# EAGLE schematic frets-main-board (EAGLE 6.6.0)
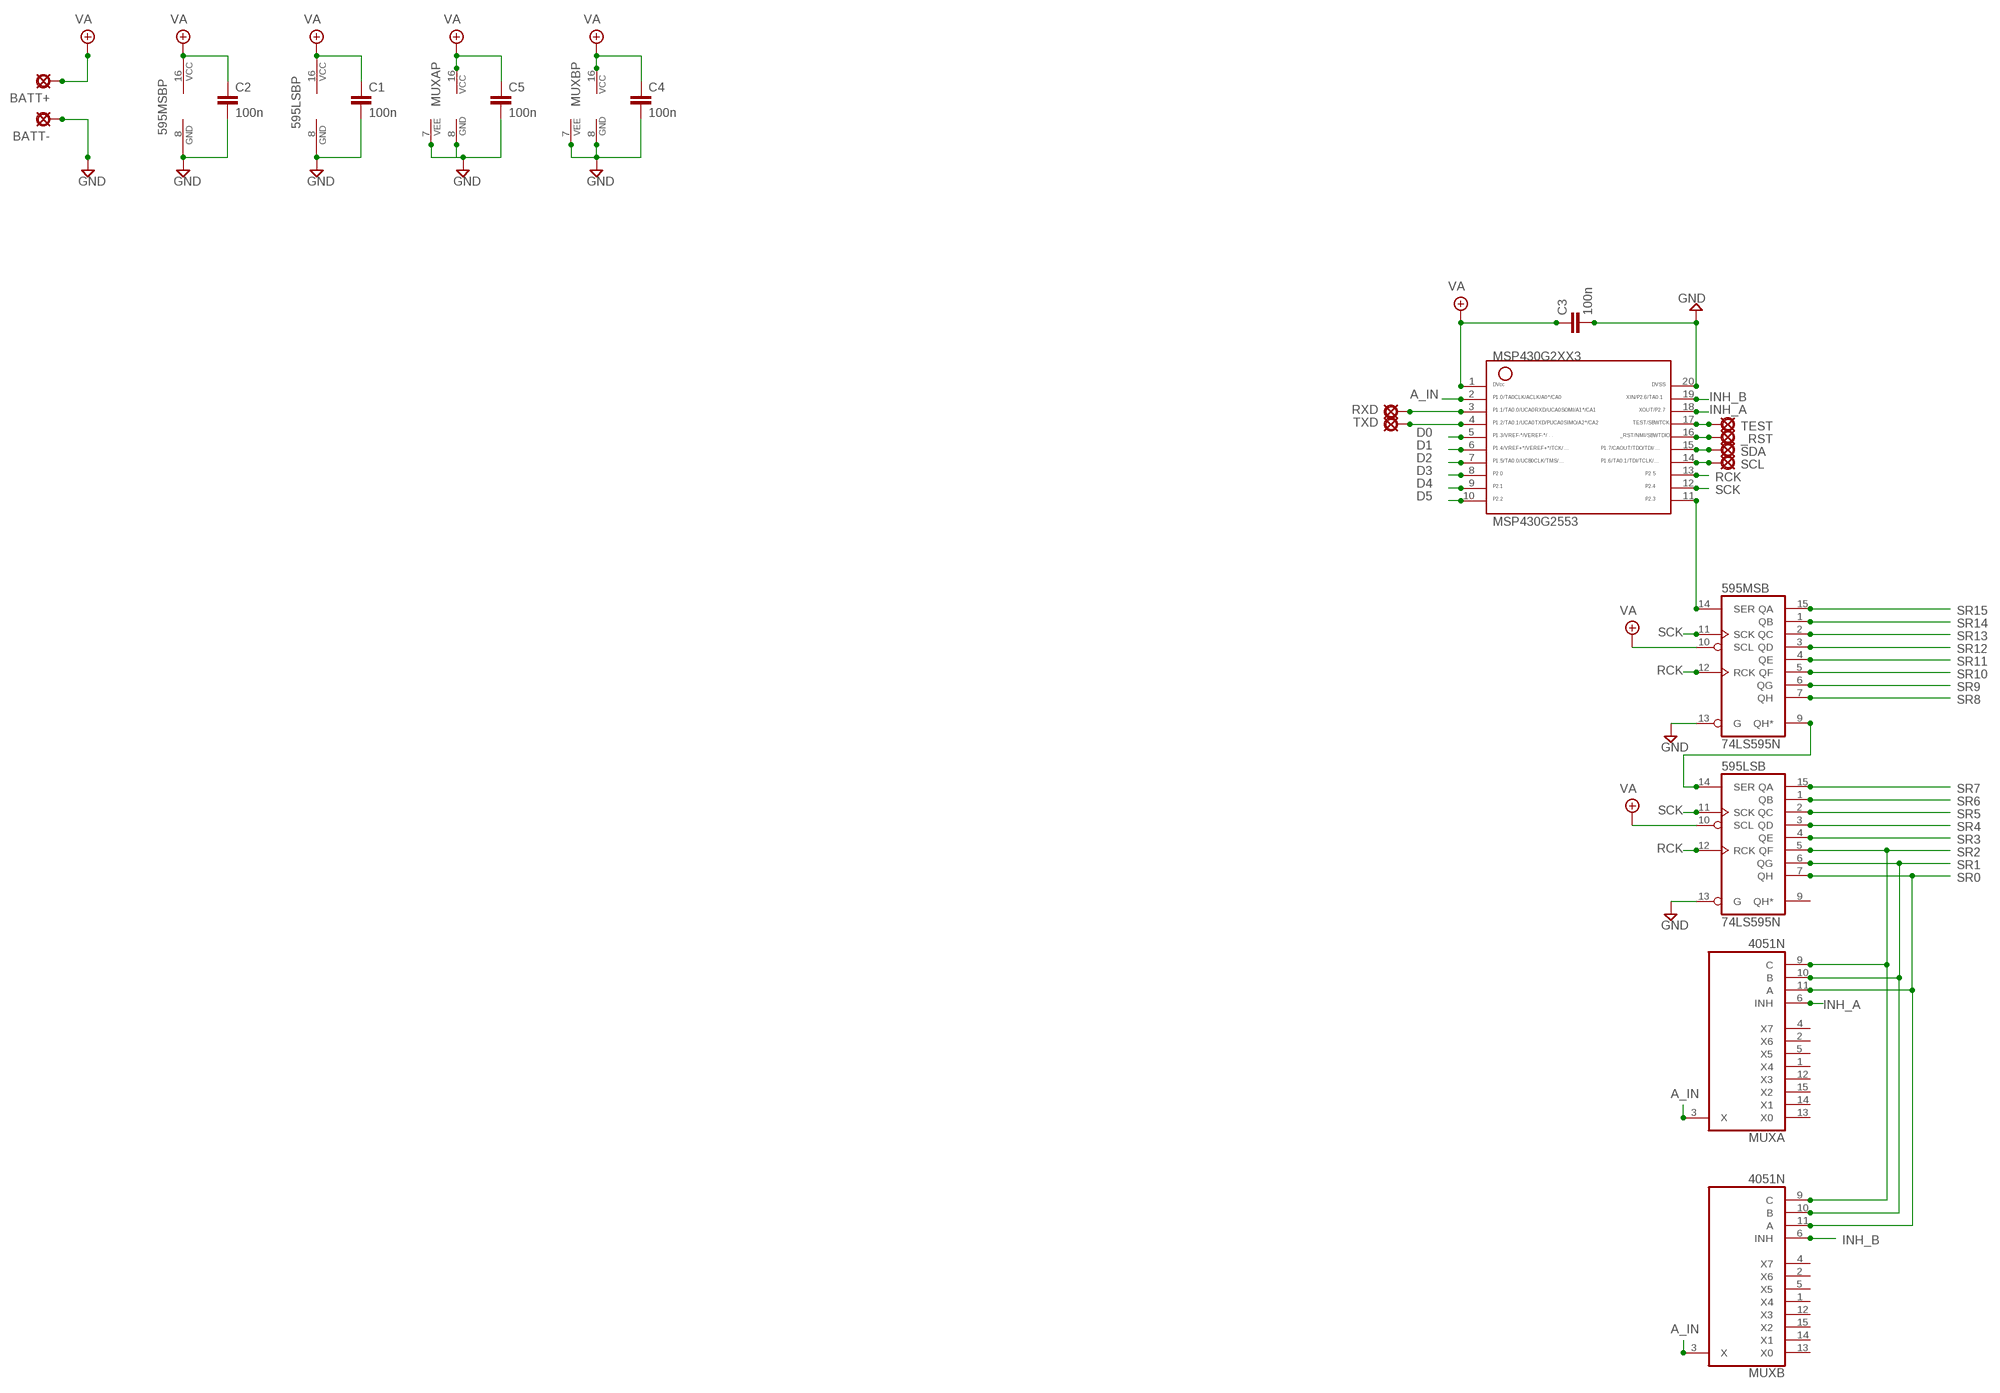
[diagram p0: schematic, sheet 1]

## Parts
595LSB  74LS595N  [DIL16]
595MSB  74LS595N  [DIL16]
_RST  PAD  [SQUARE]
BATT+  PADL  [LONG]
BATT-  PADL  [LONG]
C1  100n  050X030_050  [050X030_050_3]
C2  100n  050X030_050  [050X030_050_3]
C3  100n  050X030_050  [050X030_050_3]
C4  100n  050X030_050  [050X030_050_3]
C5  100n  050X030_050  [050X030_050_3]
MSP430G2553  G2XX3---N20  [N20]
MUXA  4051N  [DIL16]
MUXB  4051N  [DIL16]
RXD  PAD  [SQUARE]
SCL  PAD  [SQUARE]
SDA  PAD8  [OCTOGON]
TEST  PAD8  [OCTOGON]
TXD  PAD8  [OCTOGON]

## Nets
_RST: _RST.1(PAD) MSP430G2553.16
A_IN: MSP430G2553.2 MUXA.3(X) MUXB.3(X)
D0: MSP430G2553.5
D1: MSP430G2553.6
D2: MSP430G2553.7
D3: MSP430G2553.8
D4: MSP430G2553.9
D5: MSP430G2553.10
GND: 595LSB.8(GND) 595LSB.13(G) 595MSB.8(GND) 595MSB.13(G) BATT-.1(PAD) C1.2 C2.2 C3.2 C4.2 C5.2 MSP430G2553.20 MUXA.7(VEE) MUXA.8(GND) MUXB.7(VEE) MUXB.8(GND)
INH_A: MSP430G2553.18 MUXA.6(INH)
INH_B: MSP430G2553.19 MUXB.6(INH)
N$1: 595LSB.14(SER) 595MSB.9(QH*)
RCK: 595LSB.12(RCK) 595MSB.12(RCK) MSP430G2553.13
RXD: MSP430G2553.3 RXD.1(PAD)
SCK: 595LSB.11(SCK) 595MSB.11(SCK) MSP430G2553.12
SCL: MSP430G2553.14 SCL.1(PAD)
SDA: MSP430G2553.15 SDA.1(PAD)
SER: 595MSB.14(SER) MSP430G2553.11
SR0: 595LSB.7(QH) MUXA.11(A) MUXB.11(A)
SR1: 595LSB.6(QG) MUXA.10(B) MUXB.10(B)
SR2: 595LSB.5(QF) MUXA.9(C) MUXB.9(C)
SR3: 595LSB.4(QE)
SR4: 595LSB.3(QD)
SR5: 595LSB.2(QC)
SR6: 595LSB.1(QB)
SR7: 595LSB.15(QA)
SR8: 595MSB.7(QH)
SR9: 595MSB.6(QG)
SR10: 595MSB.5(QF)
SR11: 595MSB.4(QE)
SR12: 595MSB.3(QD)
SR13: 595MSB.2(QC)
SR14: 595MSB.1(QB)
SR15: 595MSB.15(QA)
TEST: MSP430G2553.17 TEST.1(PAD)
TXD: MSP430G2553.4 TXD.1(PAD)
VA: 595LSB.10(SCL) 595LSB.16(VCC) 595MSB.10(SCL) 595MSB.16(VCC) BATT+.1(PAD) C1.1 C2.1 C3.1 C4.1 C5.1 MSP430G2553.1 MUXA.16(VCC) MUXB.16(VCC)
Unconnected: 595LSB.9(QH*) MUXA.1(X4) MUXA.2(X6) MUXA.4(X7) MUXA.5(X5) MUXA.12(X3) MUXA.13(X0) MUXA.14(X1) MUXA.15(X2) MUXB.1(X4) MUXB.2(X6) MUXB.4(X7) MUXB.5(X5) MUXB.12(X3) MUXB.13(X0) MUXB.14(X1) MUXB.15(X2)

## Library data of the parts
595LSB 595MSB = 74xx-us:74*595: 8-bit SHIFT REGISTER, output latch
_RST BATT+ BATT- RXD SCL SDA TEST TXD = gm-supply:PAD: PAD use this package for pads with any purpose, including input, output, send or return various pad shapes: round, square, octogonal, long, and long offset
C1-C5 = gm-caps-ceramic:050X030_050: 120 - 150pF Xicon Ceramic Disc 5mm lead spacing
MSP430G2553 = TI_MSP430_v16:G2XX3---N20: MSP430G2XX1 PDIP (N) 20 Pin Package
MUXA MUXB = 40xx:4051: 8-channel ANALOG MULTIPLEXER